# EAGLE design Monopole_A (EAGLE 4.09)
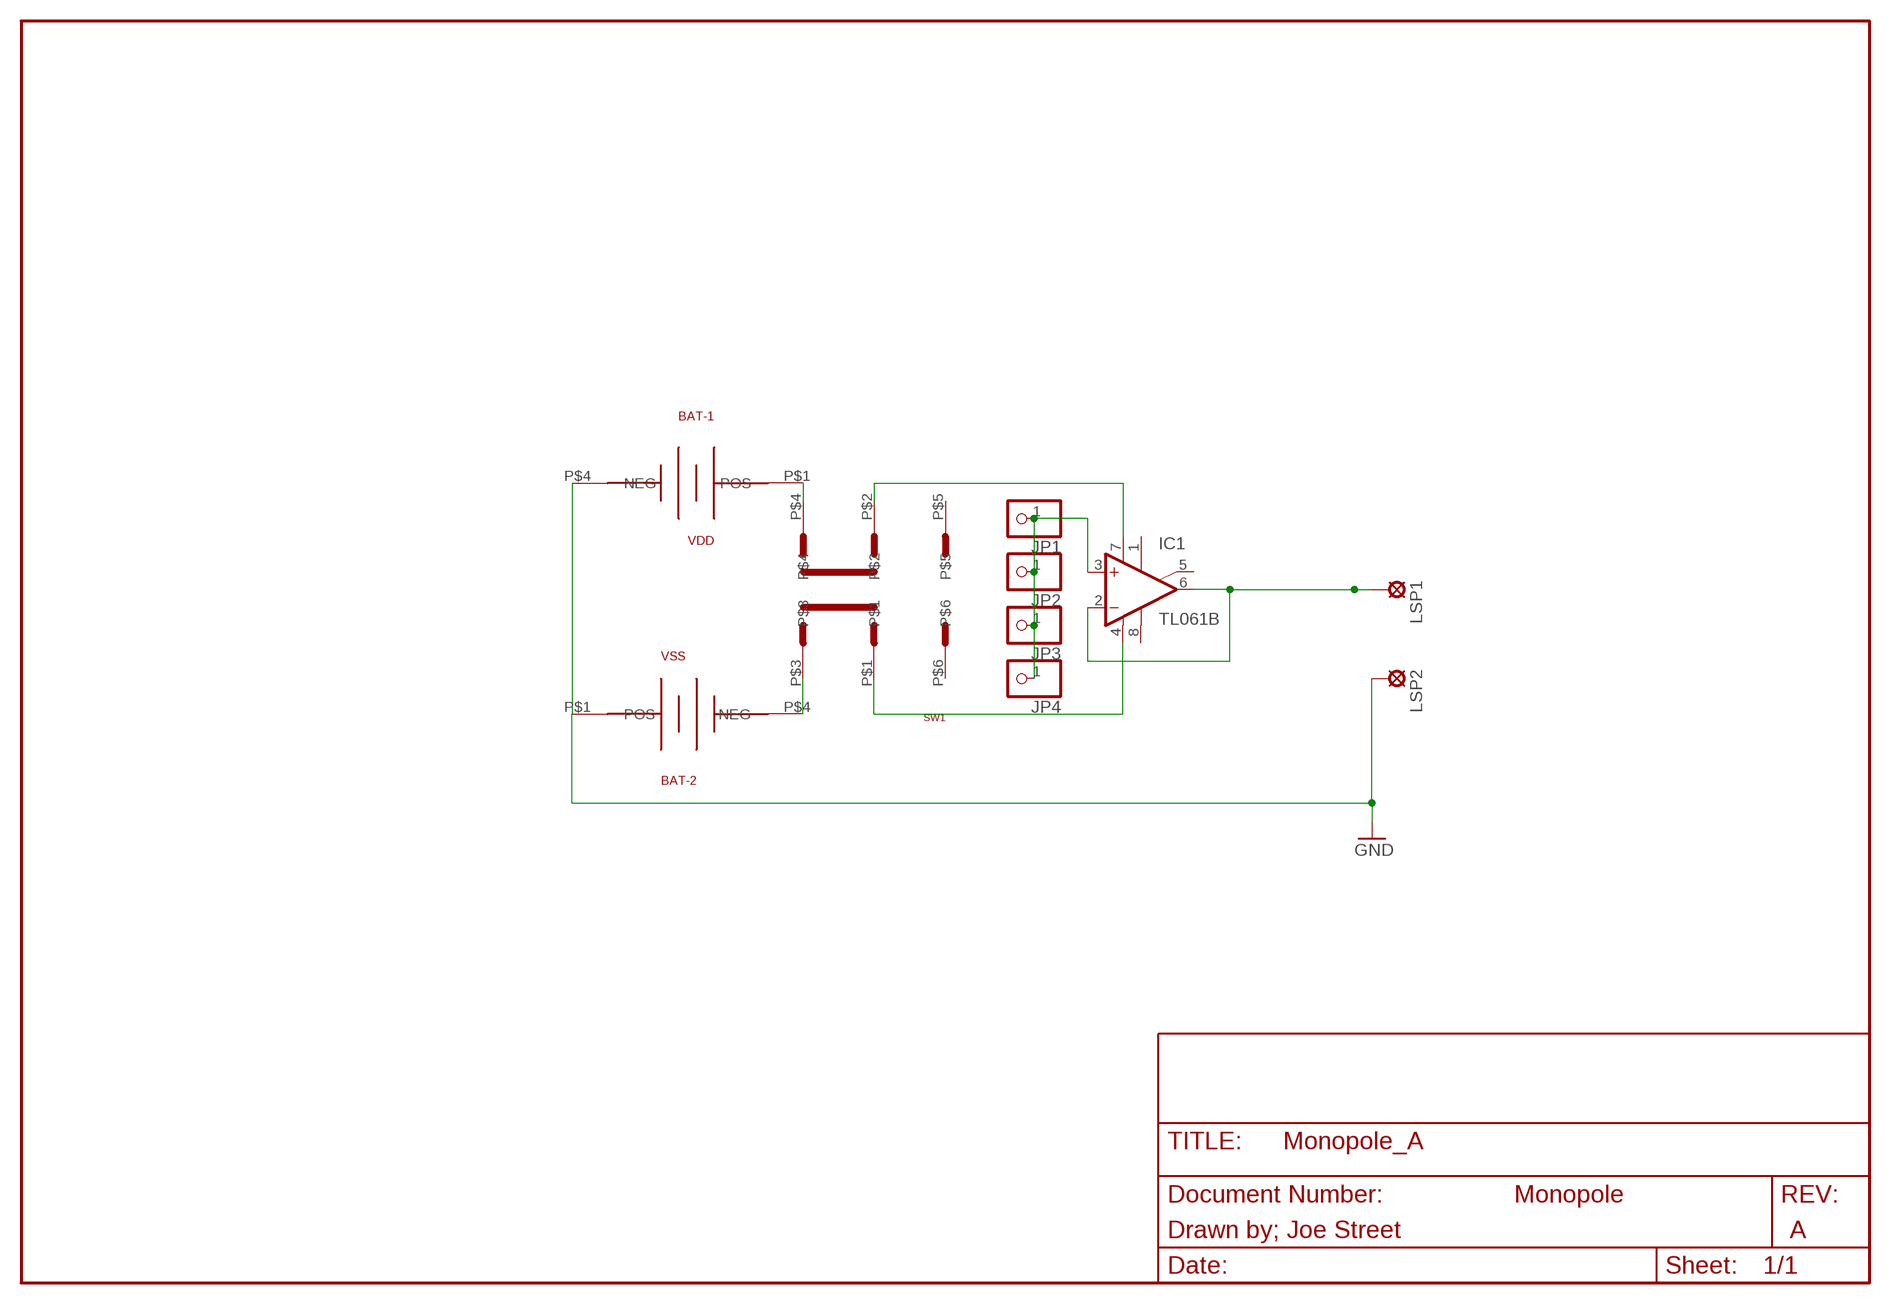
[diagram p0: schematic, sheet 1]

## Parts
IC1  TL061B  [SO08]
JP1  PINHD-1X1  [1X01]
JP2  PINHD-1X1  [1X01]
JP3  PINHD-1X1  [1X01]
JP4  PINHD-1X1  [1X01]
LSP1  LSP10  [LSP10]
LSP2  LSP10  [LSP10]
SW1  SW  [AYZ0202T]
VDD  BAT-1  [BR-T]
VSS  BAT-2  [BR-B]

## Nets
GND: LSP2.MP VDD.P$4(NEG) VSS.P$1(POS)
IN+: IC1.3(+IN) JP1.1 JP2.1 JP3.1 JP4.1
N$2: SW1.P$4 VDD.P$1(POS)
N$3: IC1.2(-IN) IC1.6(OUT) LSP1.MP
N$4: SW1.P$3 VSS.P$4(NEG)
V+: IC1.7(V+) SW1.P$2
V-: IC1.4(V-) SW1.P$1
Unconnected: IC1.1(ON1) IC1.5(ON2) IC1.8(OPT) SW1.P$5 SW1.P$6

## Notes on the sheet
- Monopole
- Drawn by; Joe Street | A

## Library data of the parts
IC1 = MY_linear:TL061: OP AMP
JP1-JP4 = pinhead:PINHD-1X1: PIN HEADER
LSP1 LSP2 = solpad:LSP10: SOLDER PAD drill 1.0 mm, distributor Buerklin, 12H555
SW1 = ITT-cannon:SW: SMD DPDT SLIDE SWITCH
VDD = keystone:BAT-1
VSS = keystone_b:BAT-2

## Board
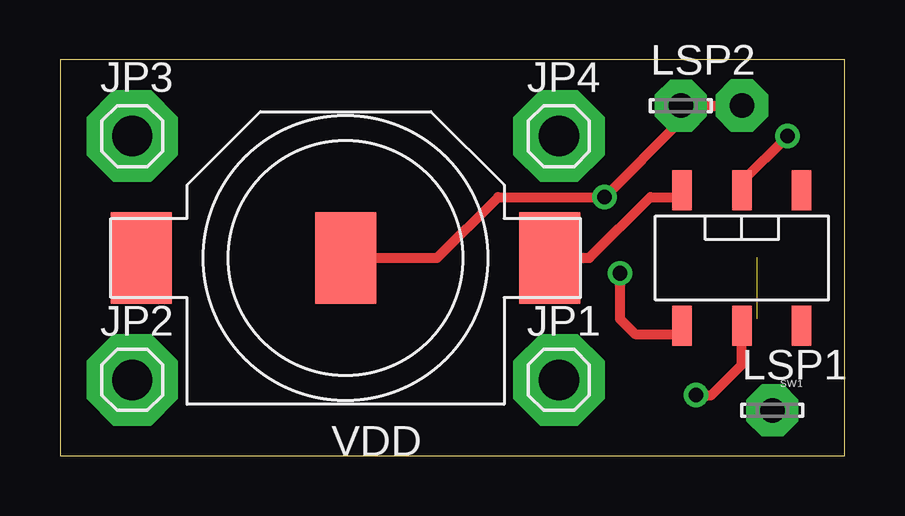
[diagram p1: board, top side]
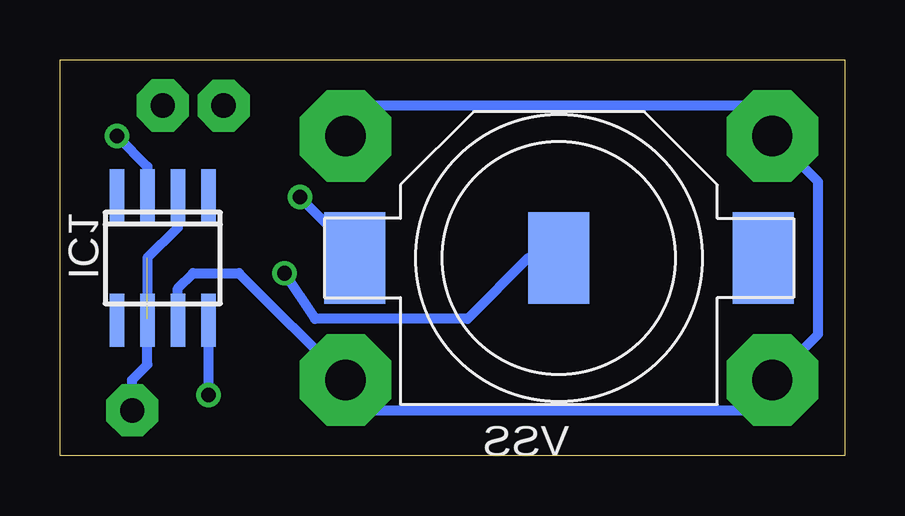
[diagram p2: board, bottom side, seen from below]

Size 32.69 x 16.5 mm. Coordinates in mm from the lower left corner, seen from the top.
Outline: 0,0 32.69,0 32.69,16.5 0,16.5 0,0
Copper layers used: Top, Bottom

### Footprints (pad centres in the part's own frame; a part is rotated, then mirrored left to right if it is on the bottom)
SO08 = smd 0.6 x 2.2 bottom: 1 -1.905,2.6; 2 -0.635,2.6; 3 0.635,2.6; 4 1.905,2.6; 5 1.905,-2.6; 6 0.635,-2.6; 7 -0.635,-2.6; 8 -1.905,-2.6
1X01 = drill 1.676 pad 3.81 octagon: 1 0,0
LSP10 = drill 1.016 pad 2.159 octagon: MP 0,0
AYZ0202T = smd 0.813 x 1.676: P$1 0,2.819; P$2 0,-2.819; P$3 2.489,2.819; P$4 2.489,-2.819; P$5 -2.489,-2.819; P$6 -2.489,2.819
BR-T = smd 2.54 x 1.27: P$1 -8.509,0; P$2 -8.509,1.27; P$3 -8.509,-1.27; P$4 0,0; P$5 0,1.27; P$6 0,-1.27; P$7 8.509,0; P$8 8.509,1.27; P$9 8.509,-1.27
BR-B = smd 2.54 x 1.27 bottom: P$1 -8.509,0; P$2 -8.509,1.27; P$3 -8.509,-1.27; P$4 0,0; P$5 0,1.27; P$6 0,-1.27; P$7 8.509,0; P$8 8.509,1.27; P$9 8.509,-1.27

### Placement (x,y rotation side)
IC1  28.41,8.25 180 top
JP1  20.79,3.17 0 top
JP2  3.01,3.17 0 top
JP3  3.01,13.33 0 top
JP4  20.79,13.33 0 top
LSP1  29.68,1.9 0 top
LSP2  25.87,14.6 0 top
SW1  28.41,8.25 180 top
VDD  11.9,8.25 180 top
VSS  11.9,8.25 180 top

### Tracks (layer width: path | path; a pad name or v marks a point on that pad's centre or on a via)
GND  (via drill 0.61 pad 1.02, 1.02 pad 2.18)
  Top 0.406: VDD.P$4 15.71,8.25 18.25,10.79 v22.7,10.79 25.87,13.97 LSP2.MP v28.41,14.6
  Bottom 0.406: VSS.P$1 20.15,8.25 v22.7,10.79
IN+
  Bottom 0.406: IC1.3 27.77,6.98 27.14,7.62 25.23,7.62 JP1.1 19.52,1.9 4.28,1.9 JP2.1 1.1,5.08 1.1,11.43 JP3.1 4.28,14.6 19.52,14.6 JP4.1
N$2
  Top 0.406: VDD.P$1 22.06,8.25 24.6,10.79 25.87,10.79 25.92,10.84 SW1.P$4
N$3  (1 unrouted)
  Bottom 0.406: LSP1.MP 29.68,3.17 29.04,3.8 IC1.2 29.04,5.71 29.04,8.25 27.77,9.52 IC1.6
N$4  (via drill 0.61 pad 1.02)
  Top 0.406: v23.33,7.62 23.33,5.71 23.96,5.08 25.87,5.08 25.92,5.13 SW1.P$3
  Bottom 0.406: VSS.P$4 13.17,8.25 15.71,5.71 22.06,5.71 v23.33,7.62
V+  (via drill 0.61 pad 1.02)
  Top 0.406: SW1.P$2 28.41,11.43 v30.31,13.33
  Bottom 0.406: v30.31,13.33 29.04,12.06 IC1.7 29.04,10.79
V-  (via drill 0.61 pad 1.02)
  Top 0.406: v26.5,2.54 27.14,2.54 28.41,3.8 SW1.P$1
  Bottom 0.406: IC1.4 v26.5,2.54